# Altium schematic sheet Power.SchDoc
size A4
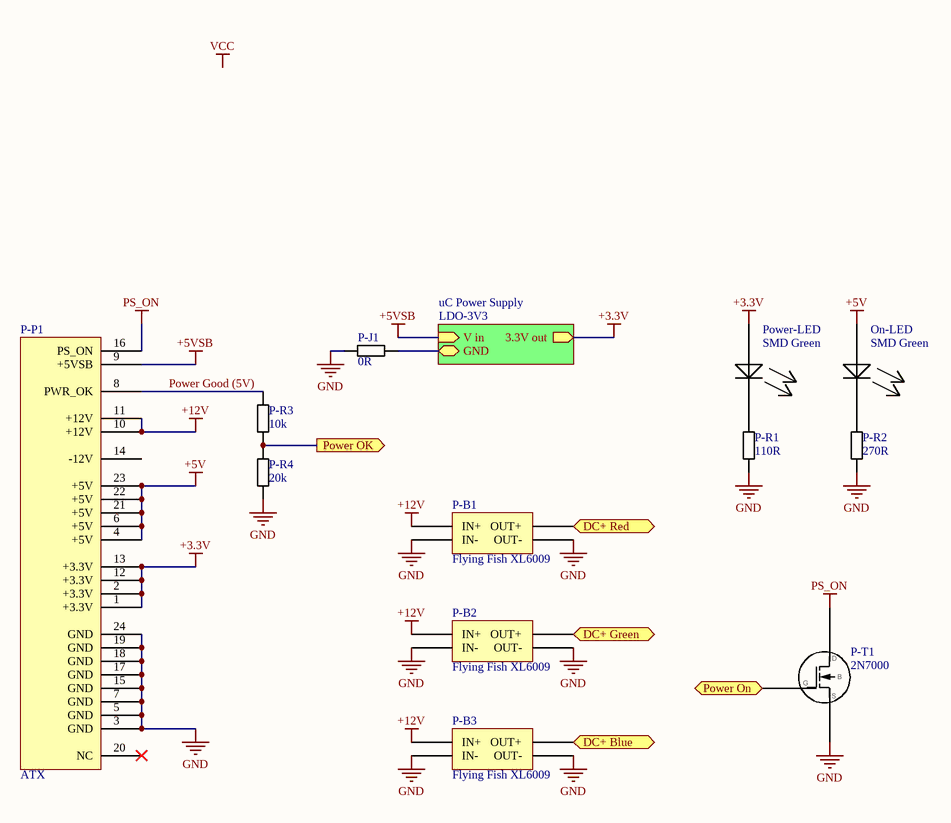
[diagram p0: Power.SchDoc]

## Parts
On-LED  SMD Green  [LED 0603]
P-B1  Flying Fish XL6009  [Flying Fish XL6009 small]
P-B2  Flying Fish XL6009  [Flying Fish XL6009 small]
P-B3  Flying Fish XL6009  [Flying Fish XL6009 small]
P-J1  0R  [R 0805 / 2012 wide]
P-P1  ATX  [ATX]
P-R1  110R  [R 0805 / 2012]
P-R2  270R  [R 0805 / 2012]
P-R3  10k  [R 0805 / 2012]
P-R4  20k  [R 0805 / 2012]
P-T1  2N7000  [SOT-23-3]
Power-LED  SMD Green  [LED 0603]

## Sub-sheets
uC Power Supply = LDO-3V3: V in (in), 3.3V out (out), GND

## Ports
DC+ Blue (out), DC+ Green (out), DC+ Red (out), Power OK (out), Power On (in)

## Nets
+3.3V: P-P1.1(+3.3V) P-P1.2(+3.3V) P-P1.12(+3.3V) P-P1.13(+3.3V) Power-LED.1(+) ; sheet uC Power Supply/3.3V out
+5V: On-LED.1(+) P-P1.4(+5V) P-P1.6(+5V) P-P1.21(+5V) P-P1.22(+5V) P-P1.23(+5V)
+5VSB: P-P1.9(+5VSB) ; sheet uC Power Supply/V in
+12V: P-B1.IN+ P-B2.IN+ P-B3.IN+ P-P1.10(+12V) P-P1.11(+12V)
GND: P-B1.IN- P-B1.OUT- P-B2.IN- P-B2.OUT- P-B3.IN- P-B3.OUT- P-J1.1 P-P1.3(GND) P-P1.5(GND) P-P1.7(GND) P-P1.15(GND) P-P1.17(GND) P-P1.18(GND) P-P1.19(GND) P-P1.24(GND) P-R1.1 P-R2.1 P-R4.1 P-T1.2
PS_ON: P-P1.16(PS_ON) P-T1.3
DC+ Blue: P-B3.OUT+ ; port DC+ Blue
DC+ Green: P-B2.OUT+ ; port DC+ Green
DC+ Red: P-B1.OUT+ ; port DC+ Red
Power Good (5V): P-P1.8(PWR_OK) P-R3.2
Power OK: P-R3.1 P-R4.2 ; port Power OK
Power On: P-T1.1 ; port Power On
NetOn-LED_2: On-LED.2(-) P-R2.2
NetP-J1_2: P-J1.2 ; sheet uC Power Supply/GND
NetP-R1_2: P-R1.2 Power-LED.2(-)

Not connected (* = marked no-connect by the designer): P-P1 14(-12V) 20(NC)*

## Notes on the sheet
- Labels drawn without touching a wire or pin: VCC

## Library data of the parts
On-LED Power-LED = LED
P-J1 P-R1-P-R4 = Resistor
P-P1 = ATX sorted
P-T1 = 2N7000: N-FET